# EAGLE design hexapodtroller_sig (EAGLE 5.11)
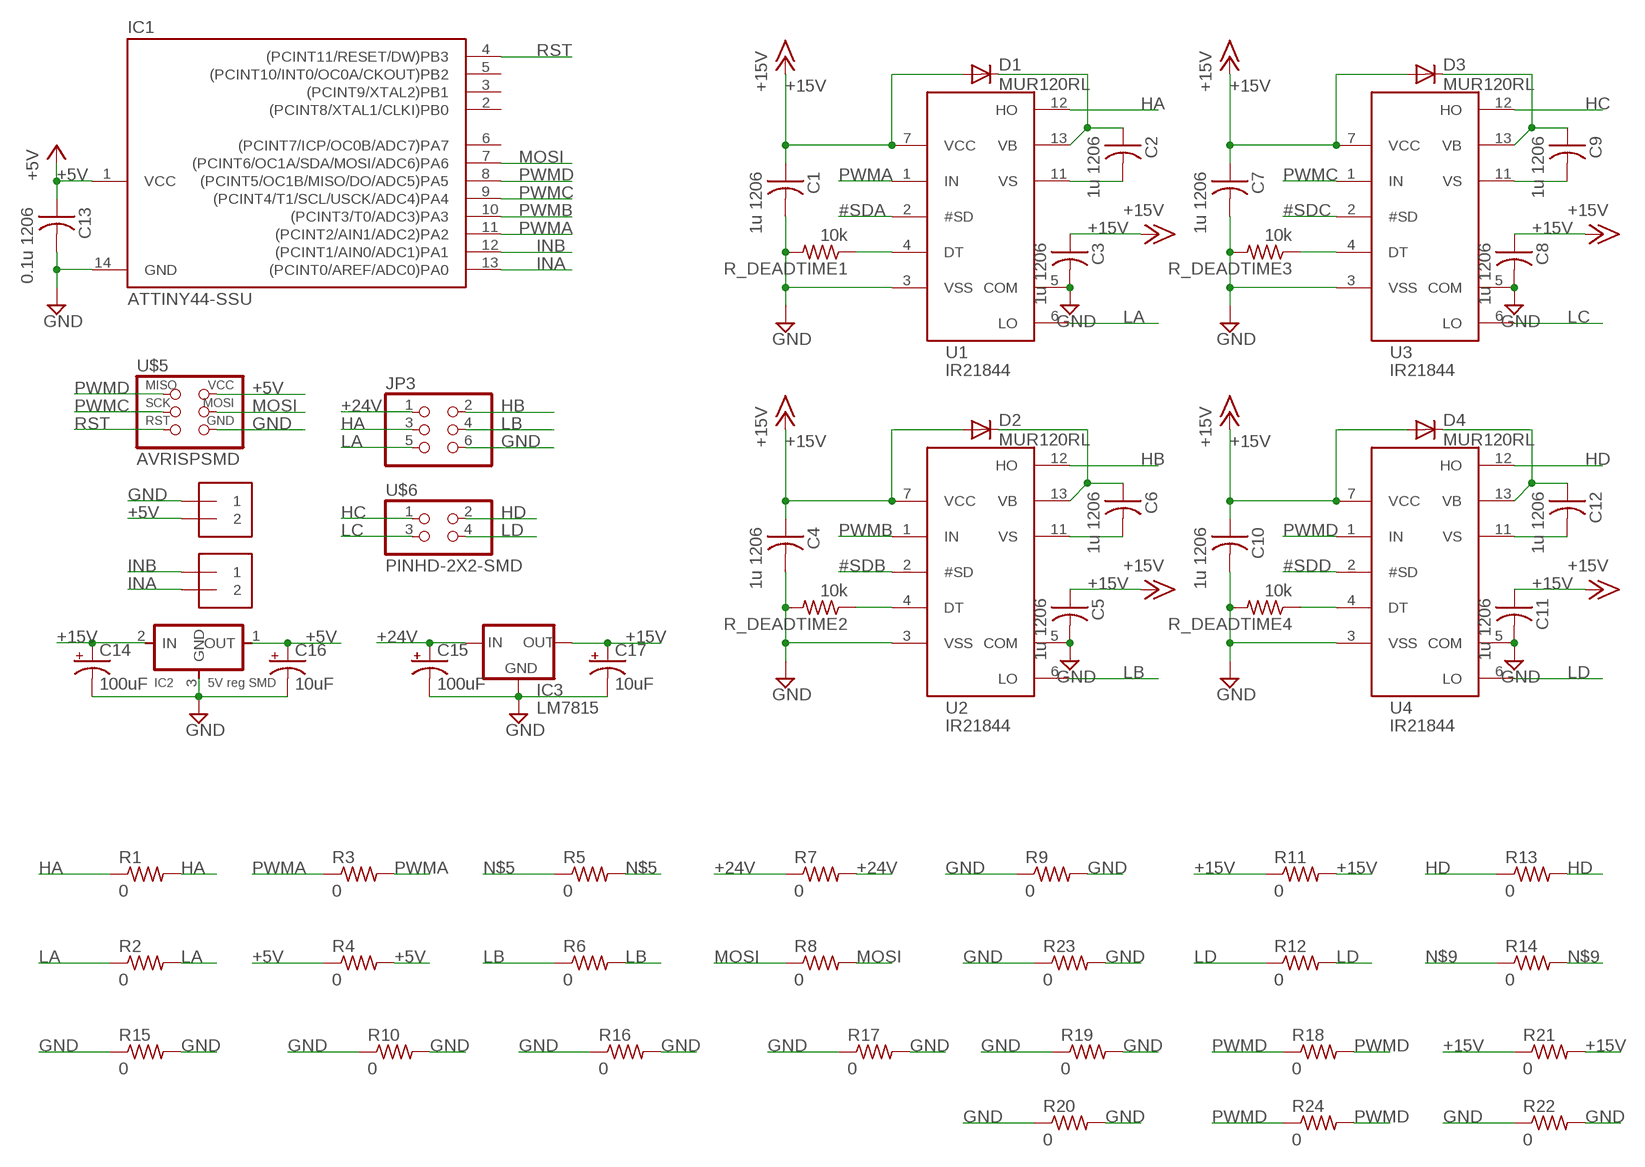
[diagram p0: schematic, sheet 1]

## Parts
C1  1u 1206  CAP-US1206FAB  [C1206FAB]
C2  1u 1206  CAP-US1206FAB  [C1206FAB]
C3  1u 1206  CAP-US1206FAB  [C1206FAB]
C4  1u 1206  CAP-US1206FAB  [C1206FAB]
C5  1u 1206  CAP-US1206FAB  [C1206FAB]
C6  1u 1206  CAP-US1206FAB  [C1206FAB]
C7  1u 1206  CAP-US1206FAB  [C1206FAB]
C8  1u 1206  CAP-US1206FAB  [C1206FAB]
C9  1u 1206  CAP-US1206FAB  [C1206FAB]
C10  1u 1206  CAP-US1206FAB  [C1206FAB]
C11  1u 1206  CAP-US1206FAB  [C1206FAB]
C12  1u 1206  CAP-US1206FAB  [C1206FAB]
C13  0.1u 1206  CAP-US1206FAB  [C1206FAB]
C14  100uF  CPOL-USE5-10.5  [E5-10,5]
C15  100uF  CPOL-USE5-10.5  [E5-10,5]
C16  10uF  CPOL-USE5-10.5  [E5-10,5]
C17  10uF  CPOL-USE5-10.5  [E5-10,5]
D1  MUR120RL  MUR150RL  [DO41-10]
D2  MUR120RL  MUR150RL  [DO41-10]
D3  MUR120RL  MUR150RL  [DO41-10]
D4  MUR120RL  MUR150RL  [DO41-10]
IC1  ATTINY44-SSU  [SOIC14]
IC2  5V reg SMD  REGULATORSOT23  [SOT23]
IC3  LM7815  78XXS  [78XXS]
J1  1X2-3.5MM  [1X2-3.5MM]
J2  1X2-3.5MM  [1X2-3.5MM]
JP3  PINHD-2X3-SMD  [2X03SMD]
R1  0  RES-US1206FAB  [R1206FAB]
R2  0  RES-US1206FAB  [R1206FAB]
R3  0  RES-US1206FAB  [R1206FAB]
R4  0  RES-US1206FAB  [R1206FAB]
R5  0  RES-US1206FAB  [R1206FAB]
R6  0  RES-US1206FAB  [R1206FAB]
R7  0  RES-US1206FAB  [R1206FAB]
R8  0  RES-US1206FAB  [R1206FAB]
R9  0  RES-US1206FAB  [R1206FAB]
R10  0  RES-US1206FAB  [R1206FAB]
R11  0  RES-US1206FAB  [R1206FAB]
R12  0  RES-US1206FAB  [R1206FAB]
R13  0  RES-US1206FAB  [R1206FAB]
R14  0  RES-US1206FAB  [R1206FAB]
R15  0  RES-US1206FAB  [R1206FAB]
R16  0  RES-US1206FAB  [R1206FAB]
R17  0  RES-US1206FAB  [R1206FAB]
R18  0  RES-US1206FAB  [R1206FAB]
R19  0  RES-US1206FAB  [R1206FAB]
R20  0  RES-US1206FAB  [R1206FAB]
R21  0  RES-US1206FAB  [R1206FAB]
R22  0  RES-US1206FAB  [R1206FAB]
R23  0  RES-US1206FAB  [R1206FAB]
R24  0  RES-US1206FAB  [R1206FAB]
R_DEADTIME1  10k  RES-US1206FAB  [R1206FAB]
R_DEADTIME2  10k  RES-US1206FAB  [R1206FAB]
R_DEADTIME3  10k  RES-US1206FAB  [R1206FAB]
R_DEADTIME4  10k  RES-US1206FAB  [R1206FAB]
U1  IR21844  [IR21844]
U2  IR21844  [IR21844]
U3  IR21844  [IR21844]
U4  IR21844  [IR21844]
U$5  AVRISPSMD  [2X03SMD]
U$6  PINHD-2X2-SMD  [2X02SMD]

## Nets
#SDA: U1.2(#SD)
#SDB: U2.2(#SD)
#SDC: U3.2(#SD)
#SDD: U4.2(#SD)
+5V: C13.1 C16.+ IC1.1(VCC) IC2.1(OUT) J1.2 R4.1 R4.2 U$5.2(VCC)
+15V: C1.1 C3.1 C4.1 C5.1 C7.1 C8.1 C10.1 C11.1 C14.+ C17.+ D1.A D2.A D3.A D4.A IC2.2(IN) IC3.OUT R11.1 R11.2 R21.1 R21.2 U1.7(VCC) U2.7(VCC) U3.7(VCC) U4.7(VCC)
+24V: C15.+ IC3.IN JP3.1 R7.1 R7.2
GND: C1.2 C3.2 C4.2 C5.2 C7.2 C8.2 C10.2 C11.2 C13.2 C14.- C15.- C16.- C17.- IC1.14(GND) IC2.3(GND) IC3.GND J1.1 JP3.6 R9.1 R9.2 R10.1 R10.2 R15.1 R15.2 R16.1 R16.2 R17.1 R17.2 R19.1 R19.2 R20.1 R20.2 R22.1 R22.2 R23.1 R23.2 R_DEADTIME1.2 R_DEADTIME2.2 R_DEADTIME3.2 R_DEADTIME4.2 U1.3(VSS) U1.5(COM) U2.3(VSS) U2.5(COM) U3.3(VSS) U3.5(COM) U4.3(VSS) U4.5(COM) U$5.6(GND)
HA: JP3.3 R1.1 R1.2 U1.12(HO)
HB: JP3.2 U2.12(HO)
HC: U3.12(HO) U$6.1
HD: R13.1 R13.2 U4.12(HO) U$6.2
INA: IC1.13((PCINT0/AREF/ADC0)PA0) J2.2
INB: IC1.12((PCINT1/AIN0/ADC1)PA1) J2.1
LA: JP3.5 R2.1 R2.2 U1.6(LO)
LB: JP3.4 R6.1 R6.2 U2.6(LO)
LC: U3.6(LO) U$6.3
LD: R12.1 R12.2 U4.6(LO) U$6.4
MOSI: IC1.7((PCINT6/OC1A/SDA/MOSI/ADC6)PA6) R8.1 R8.2 U$5.4(MOSI)
N$1: R_DEADTIME1.1 U1.4(DT)
N$2: C2.1 D1.C U1.13(VB)
N$3: C2.2 U1.11(VS)
N$4: R_DEADTIME2.1 U2.4(DT)
N$5: C6.1 D2.C R5.1 R5.2 U2.13(VB)
N$6: C6.2 U2.11(VS)
N$8: R_DEADTIME3.1 U3.4(DT)
N$9: C9.1 D3.C R14.1 R14.2 U3.13(VB)
N$10: C9.2 U3.11(VS)
N$11: R_DEADTIME4.1 U4.4(DT)
N$12: C12.1 D4.C U4.13(VB)
N$13: C12.2 U4.11(VS)
PWMA: IC1.11((PCINT2/AIN1/ADC2)PA2) R3.1 R3.2 U1.1(IN)
PWMB: IC1.10((PCINT3/T0/ADC3)PA3) U2.1(IN)
PWMC: IC1.9((PCINT4/T1/SCL/USCK/ADC4)PA4) U3.1(IN) U$5.3(SCK)
PWMD: IC1.8((PCINT5/OC1B/MISO/DO/ADC5)PA5) R18.1 R18.2 R24.1 R24.2 U4.1(IN) U$5.1(MISO)
RST: IC1.4((PCINT11/RESET/DW)PB3) U$5.5(RST)
Unconnected: IC1.2((PCINT8/XTAL1/CLKI)PB0) IC1.3((PCINT9/XTAL2)PB1) IC1.5((PCINT10/INT0/OC0A/CKOUT)PB2) IC1.6((PCINT7/ICP/OC0B/ADC7)PA7)

## Library data of the parts
C1-C13 = fab:CAP-US
C14-C17 = rcl:CPOL-US: POLARIZED CAPACITOR, American symbol
D1-D4 = diode:MUR150RL: DIODE
IC1 = fab:ATTINY44
IC2 = fab:REGULATOR
IC3 = v-reg:78XXS: VOLTAGE REGULATOR
J1 J2 = adafruit:1X2: 3.5mm Terminal block http://www.ladyada.net/library/pcb/eaglelibrary.html
JP3 = fab:PINHD-2X3-SMD: PIN HEADER
R1-R24 R_DEADTIME1-R_DEADTIME4 = fab:RES-US: Resistor (US Symbol) Variants with postfix FAB are widened to allow the routing of internal traces
U1-U4 = charleses_parts_bin:IR21844: IR21844S 2A Half-bridge driver with dead time SOIC-14
U$5 = fab:AVRISP
U$6 = fab:PINHD-2X2-SMD

## Board
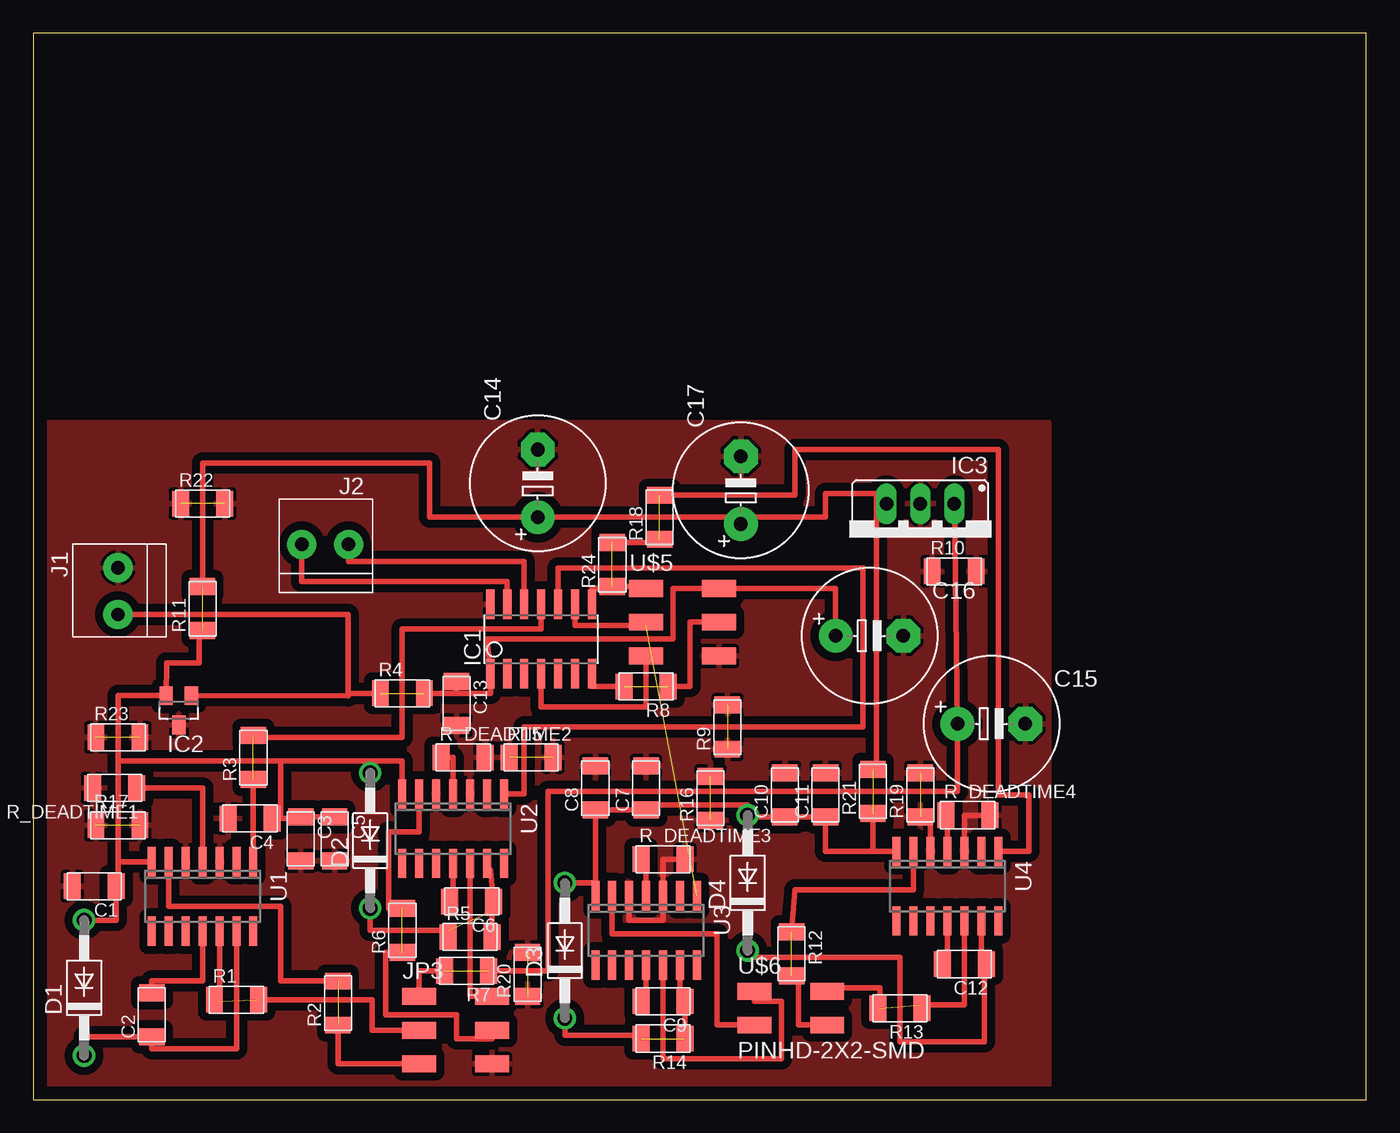
[diagram p1: board, top side]

Size 100 x 80 mm. Coordinates in mm from the lower left corner, seen from the top.
Outline: 0,0 100,0 100,80 0,80 0,0
Copper layers (1*16): Top 0.035mm / dielectric 1.5mm / Bottom 0.035mm
Design rules "default": minimum track width 10mil, minimum drill 24mil, track to track 8mil, track to pad 8mil, pad to pad 8mil, via to via 8mil, smd to smd 8mil, copper to edge 40mil, drill to drill 8mil, minimum pad ring 10mil, minimum via ring 8mil, stop-mask expansion 4mil, vias tented up to drill 0mil, thermal gap 10mil

### Footprints (pad centres in the part's own frame; a part is rotated, then mirrored left to right if it is on the bottom)
C1206FAB = smd 1.27 x 1.905: 1 -1.651,0; 2 1.651,0
E5-10,5 = drill 1.016 pad 2.54 round: + -2.54,0 | drill 1.016 pad 2.54 octagon: - 2.54,0
DO41-10 = drill 1.118 round: A 5.08,0; C -5.08,0
SOIC14 = smd 0.61 x 2.21: 1 -3.81,-2.603; 2 -2.54,-2.603; 3 -1.27,-2.603; 4 0,-2.603; 5 1.27,-2.603; 6 2.54,-2.603; 7 3.81,-2.603; 8 3.81,2.603; 9 2.54,2.603; 10 1.27,2.603; 11 0,2.603; 12 -1.27,2.603; 13 -2.54,2.603; 14 -3.81,2.603
SOT23 = smd 1 x 1.4: 1 -0.95,-1.1; 2 0.95,-1.1; 3 0,1.1
78XXS = drill 1.016 long: GND 0,-2.54; IN -2.54,-2.54; OUT 2.54,-2.54
1X2-3.5MM = drill 1 pad 2.184 round: 1 1.8,0; 2 -1.7,0
2X03SMD = smd 2.54 x 1.27: 1 -2.54,2.54; 2 2.92,2.54; 3 -2.54,0; 4 2.92,0; 5 -2.54,-2.54; 6 2.92,-2.54
R1206FAB = smd 1.27 x 1.905: 1 -1.651,0; 2 1.651,0
IR21844 = smd 0.6 x 2.2: 1 -5.08,-2.6; 2 -3.81,-2.6; 3 -2.54,-2.6; 4 -1.27,-2.6; 5 0,-2.6; 6 1.27,-2.6; 7 2.54,-2.6; 8 2.54,2.6; 9 1.27,2.6; 10 0,2.6; 11 -1.27,2.6; 12 -2.54,2.6; 13 -3.81,2.6; 14 -5.08,2.6
2X02SMD = smd 2.54 x 1.27: 1 -2.54,1.27; 2 2.92,1.27; 3 -2.54,-1.27; 4 2.92,-1.27

### Placement (x,y rotation side)
C1  4.57,16 180 top
C2  8.89,6.35 90 top
C3  20.07,19.56 270 top
C4  16.26,21.08 180 top
C5  22.61,19.56 270 top
C6  32.89,14.86 180 top
C7  45.97,23.37 90 top
C8  42.16,23.37 90 top
C9  47.24,7.37 180 top
C10  56.39,22.86 90 top
C11  59.44,22.86 90 top
C12  69.85,10.16 180 top
C13  31.75,29.72 270 top
C14  37.85,46.23 90 top
C15  71.88,28.19 0 top
C16  62.74,34.8 0 top
C17  53.09,45.72 90 top
D1  3.81,8.38 90 top
D2  25.27,19.43 90 top
D3  39.88,11.18 90 top
D4  53.59,16.26 90 top
IC1  38.1,34.54 0 top
IC2  10.92,29.21 180 top
IC3  66.55,42.16 180 top
J1  6.35,38.1 90 top
J2  21.84,41.66 0 top
JP3  31.5,5.21 0 top
R1  15.24,7.49 0 top
R2  22.86,7.24 90 top
R3  16.51,25.65 90 top
R4  27.69,30.48 0 top
R5  32.77,12.19 0 top
R6  27.69,12.7 90 top
R7  32.51,9.65 180 top
R8  45.97,30.99 180 top
R9  52.07,27.94 90 top
R10  69.09,39.62 0 top
R11  12.7,36.83 90 top
R12  56.9,10.92 270 top
R13  65.02,6.86 180 top
R14  47.24,4.57 180 top
R15  37.34,25.65 0 top
R16  50.8,22.61 90 top
R17  6.35,20.57 0 top
R18  46.99,43.69 90 top
R19  66.55,22.86 90 top
R20  37.08,9.4 90 top
R21  62.99,23.11 90 top
R22  12.7,44.7 0 top
R23  6.35,27.18 0 top
R24  43.43,40.13 90 top
R_DEADTIME1  6.1,23.37 180 top
R_DEADTIME2  32.26,25.65 0 top
R_DEADTIME3  47.24,18.03 0 top
R_DEADTIME4  70.1,21.34 0 top
U1  11.43,15.24 180 top
U2  30.23,20.32 180 top
U3  44.7,12.7 180 top
U4  67.31,16 180 top
U$5  48.51,35.81 0 top
U$6  56.64,6.86 0 top

### Tracks (layer width: path | path; a pad name or v marks a point on that pad's centre or on a via)
+5V  (1 unrouted)
  Top 0.406: 23.62,30.48 R4.1 | 23.62,30.48 23.62,36.4 J1.2 | R4.2 31.75,30.48 | 31.75,30.48 C13.1 | 31.75,30.48 34.29,30.48 IC1.1 34.04,34.54 48.01,34.54 48.01,38.35 U$5.2 60.2,38.35 C16.+ | IC2.1 23.62,30.29 23.62,30.48
+15V  (2 unrouted)
  Top 0.406: 6.35,25.4 6.35,30.31 IC2.2 9.99,32.77 12.45,32.77 12.45,35.18 R11.1 | 6.35,17.84 U1.7 | 6.35,17.84 6.35,25.4 | 18.54,25.4 25.27,25.4 | 6.35,25.4 18.54,25.4 | 18.54,25.4 18.54,21.08 | 18.54,21.08 C4.1 | 18.54,21.08 20.32,21.08 C3.1 C5.1 | 25.27,25.4 D2.A | 25.27,25.4 27.69,25.4 U2.7 | 53.09,43.69 59.44,43.69 59.44,45.47 63.25,45.47 | 53.09,43.69 C17.+ | 53.09,43.69 C14.+ 29.72,43.69 29.72,47.75 12.7,47.75 R11.2 | 42.16,16.26 U3.7 | 62.99,18.6 U4.7 | D4.A 53.59,21.97 | D3.A 42.16,16.26 | 42.16,16.26 C8.1 C7.1 45.97,22.1 53.59,22.1 D4.A | 6.35,17.84 6.35,15.11 C1.1 6.22,13.46 D1.A | 63.25,45.47 IC3.OUT | R21.2 63.25,24.77 63.25,45.47 | 62.99,18.6 59.44,18.6 C11.1 C10.1 53.59,21.21 D4.A | 62.99,18.6 R21.1
+24V  (1 unrouted)
  Top 0.406: R7.2 28.96,9.65 JP3.1 | R7.1 38.61,9.65 38.61,23.11 69.34,23.11 C15.+ | C15.+ 69.6,27.94 | C15.+ IC3.IN
GND  (8 unrouted)
  Top 0.406: U3.5 44.7,13.46 47.24,13.46 U3.3 47.24,18.03 R_DEADTIME3.2 | U4.5 67.31,21.08 66.55,21.08 R19.1 | 71.88,21.34 R_DEADTIME4.2 69.85,21.34 U4.3
  pour Top (isolate 0.61): 0,0 76.2,0 76.2,50.8 0,50.8
HA  (1 unrouted)
  Top 0.406: U1.12 13.97,7.37 R1.1 | 16.76,7.49 R1.2 25.4,7.49 25.4,5.21 JP3.3
HB
  Top 0.406: U2.12 32.77,7.75 JP3.2
HC
  Top 0.406: U3.12 47.24,3.05 56.13,3.05 56.13,7.37 54.1,7.37 U$6.1
HD  (1 unrouted)
  Top 0.406: U4.12 69.85,7.11 66.67,7.11 R13.1 | U$6.2 59.56,8.38 63.5,8.38 63.5,6.86 R13.2
INA
  Top 0.406: IC1.13 35.56,38.86 20.14,38.86 J2.2
INB
  Top 0.406: IC1.12 36.83,40.39 23.64,40.39 J2.1
LA  (1 unrouted)
  Top 0.406: U1.6 10.16,14.48 18.54,14.48 18.54,8.89 R2.2 | R2.1 22.86,2.67 JP3.5
LB  (1 unrouted)
  Top 0.406: U2.6 28.96,20.07 26.67,20.07 26.67,14.35 R6.2 | R6.1 26.42,11.05 26.42,6.35 31.75,6.35 31.75,4.57 34.42,4.57 JP3.4
LC
  Top 0.406: U$6.3 51.31,5.59 51.31,12.45 43.43,12.45 U3.6
LD  (1 unrouted)
  Top 0.406: U4.6 66.04,15.75 57.15,15.75 R12.1 | U$6.4 57.4,5.59 57.4,9.14 56.9,9.14 R12.2
MOSI  (1 unrouted)
  Top 0.406: IC1.7 41.91,30.99 R8.2 | R8.1 49.28,30.99 49.28,35.81 U$5.4
N$1
  Top 0.406: 12.83,17.84 U1.4 12.7,23.37 R_DEADTIME1.1
N$2
  Top 0.406: U1.13 15.24,3.81 8.89,3.81 C2.1 3.81,4.7 D1.C
N$3
  Top 0.406: U1.11 12.7,8.89 8.89,8.89 C2.2
N$4
  Top 0.406: U2.4 31.5,25.65 R_DEADTIME2.1
N$5  (1 unrouted)
  Top 0.406: 34.42,13.97 34.04,13.97 | U2.13 34.29,17.21 C6.1 34.54,13.97 34.42,13.97 | R5.2 34.42,13.97 | R5.1 31.11,12.7 25.27,12.7 D2.C
N$6
  Top 0.406: U2.11 31.5,13.97 30.99,13.97 C6.2
N$8
  Top 0.406: U3.4 45.97,18.03 R_DEADTIME3.1
N$9  (1 unrouted)
  Top 0.406: U3.13 48.51,7.37 C9.1 R14.1 | D3.C 39.88,4.83 45.59,4.83 R14.2
N$10
  Top 0.406: C9.2 45.97,7.37 U3.11
N$11
  Top 0.406: R_DEADTIME4.1 68.58,21.34 U4.4
N$12
  Top 0.406: D4.C 53.59,10.67 65.02,10.67 65.02,4.32 71.37,4.32 71.37,10.16 C12.1 71.12,10.16 U4.13
N$13
  Top 0.406: 68.33,10.16 C12.2 68.58,10.16 U4.11
PWMA  (1 unrouted)
  Top 0.406: U1.1 R3.1 | IC1.11 38.1,35.31 27.69,35.31 27.69,27.18 16.51,27.18 R3.2
PWMB
  Top 0.406: U2.1 36.83,22.92 36.83,27.94 62.23,27.94 62.23,39.88 39.37,39.88 IC1.10
PWMC  (1 unrouted)
  Top 0.406: IC1.9 40.64,35.56 45.97,35.56 U$5.3
PWMD  (2 unrouted)
  Top 0.406: R18.2 57.15,45.34 57.15,48.77 72.39,48.77 72.39,22.86 74.68,22.86 74.68,18.6 U4.1 | R24.2 46.99,41.78 R18.1 | IC1.8 41.91,38.35 43.43,38.35 R24.1 45.97,38.48 U$5.1
RST
  Top 0.406: IC1.4 38.1,29.46 45.97,29.46 U$5.5